# EAGLE design SparkFun_Level_Translator_PCA9306 (EAGLE 9.4.0)
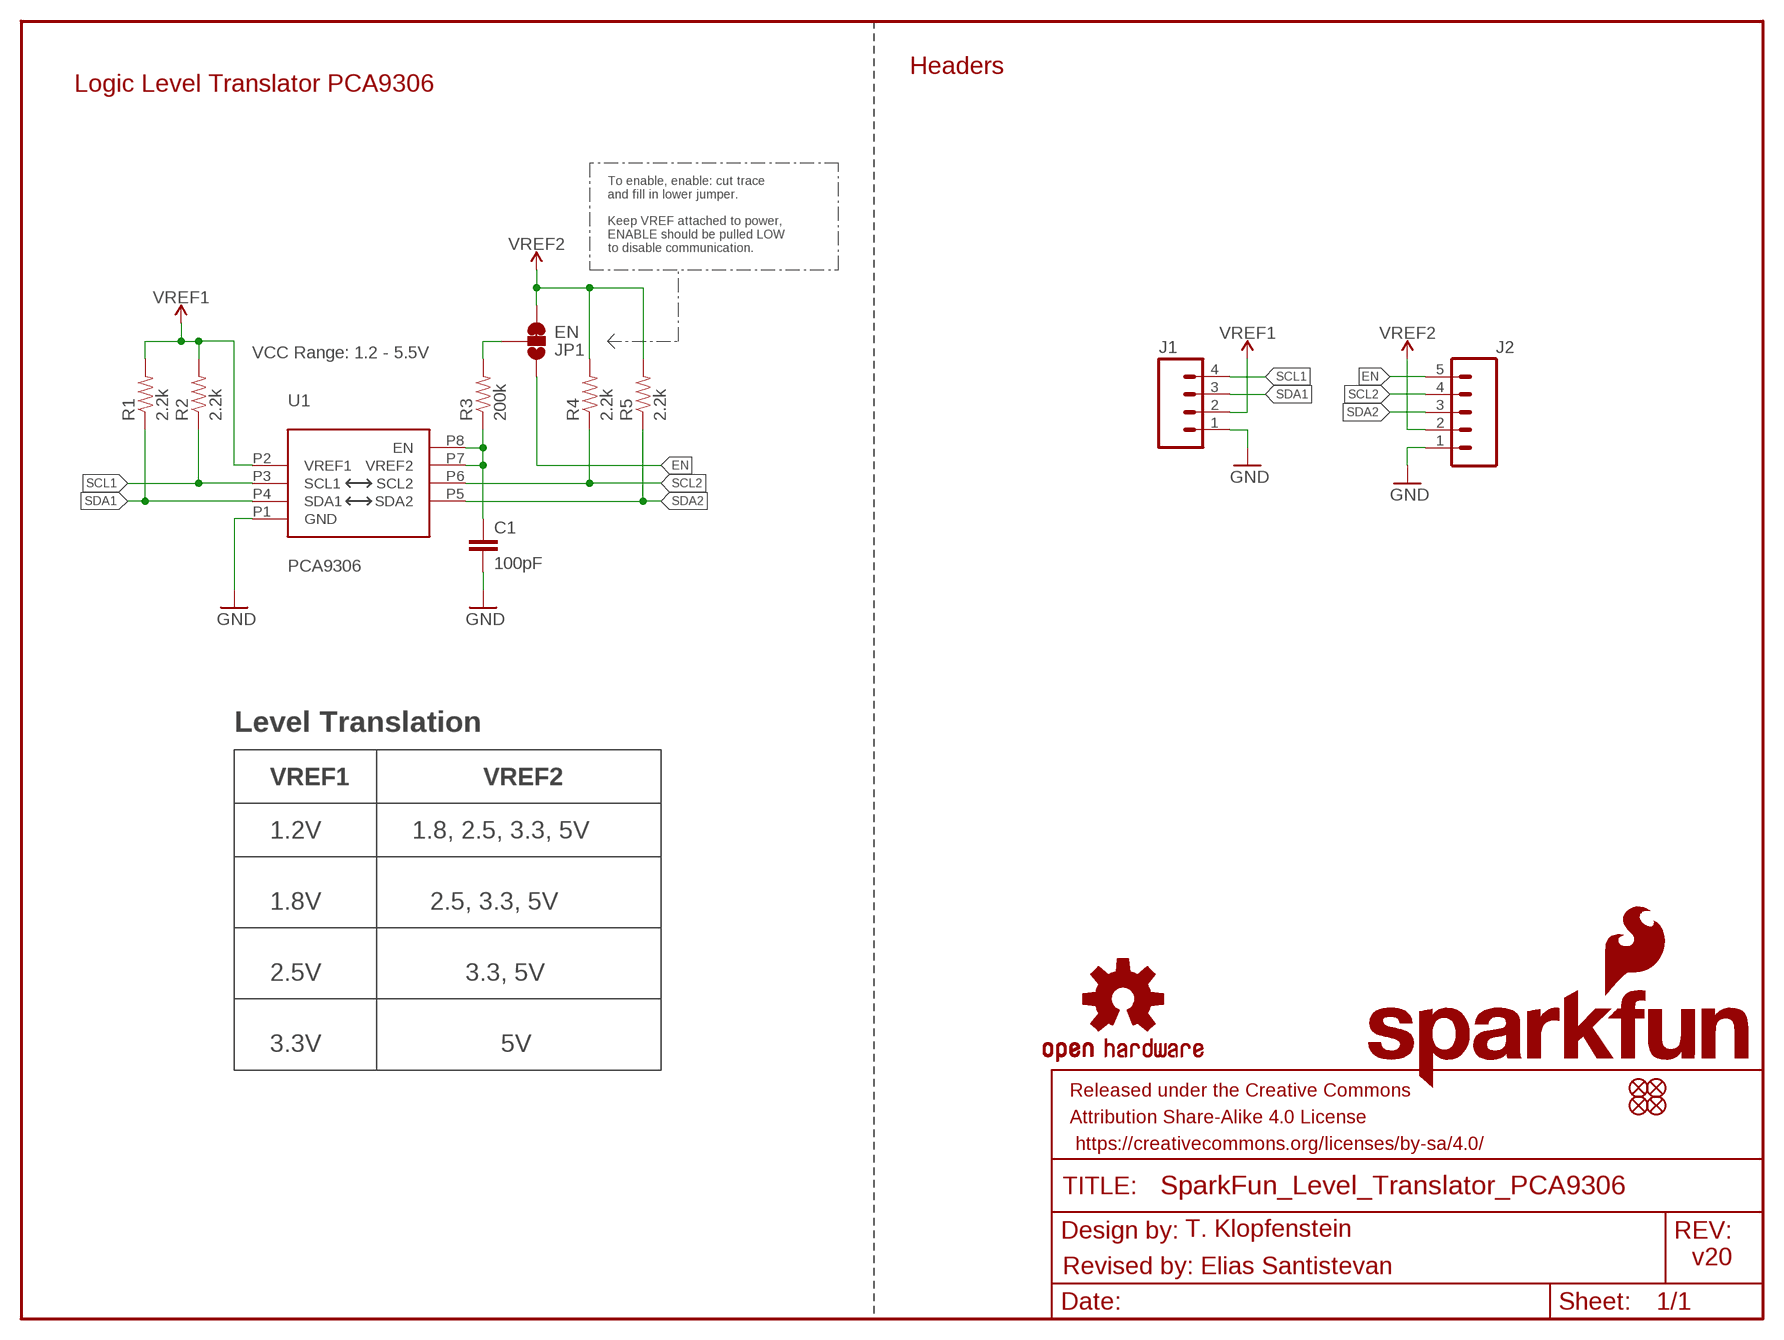
[diagram p0: schematic, sheet 1]

## Parts
C1  100pF  100PF-0603-50V-5%  [0603]
FD1  FIDUCIALUFIDUCIAL  [FIDUCIAL-MICRO]
FD2  FIDUCIALUFIDUCIAL  [FIDUCIAL-MICRO]
FD3  FIDUCIALUFIDUCIAL  [FIDUCIAL-MICRO]
FD4  FIDUCIALUFIDUCIAL  [FIDUCIAL-MICRO]
FRAME1  FRAME-LETTER  [CREATIVE_COMMONS]
J1  CONN_041X04_NO_SILK  [1X04_NO_SILK]
J2  CONN_05NO_SILK  [1X05_NO_SILK]
JP1  EN  JUMPER-SMT_3_1-NC_TRACE_SILK  [SMT-JUMPER_3_1-NC_TRACE_SILK]
LOGO1  OSHW-LOGOMINI  [OSHW-LOGO-MINI]
LOGO2  SFE_LOGO_NAME.1_INCH  [SFE_LOGO_NAME_.1]
LOGO3  SFE_LOGO_FLAME.1_INCH  [SFE_LOGO_FLAME_.1]
R1  2.2k  2.2KOHM-0603-1/10W-1%  [0603]
R2  2.2k  2.2KOHM-0603-1/10W-1%  [0603]
R3  200k  200KOHM-0603-1/10W-1%  [0603]
R4  2.2k  2.2KOHM-0603-1/10W-1%  [0603]
R5  2.2k  2.2KOHM-0603-1/10W-1%  [0603]
U1  PCA9306  PCA9306VSSOP_8PIN  [VSSOP_8PIN]

## Nets
EN: J2.5 JP1.1
GND: C1.2 J1.1 J2.1 U1.P1(GND)
JUMPER_IN: JP1.2 R3.2
SCL1: J1.4 R2.1 U1.P3(SCL1)
SCL2: J2.4 R4.1 U1.P6(SCL2)
SDA1: J1.3 R1.1 U1.P4(SDA1)
SDA2: J2.3 R5.1 U1.P5(SDA2)
VREF1: J1.2 R1.2 R2.2 U1.P2(VREF1)
VREF2: J2.2 JP1.3 R4.2 R5.2
VREF2_IN: C1.1 R3.1 U1.P7(VREF2) U1.P8(EN)

## Notes on the sheet
- Headers
- Logic Level Translator PCA9306
- To enable, enable: cut trace
  and fill in lower jumper.
- Keep VREF attached to power, 
  ENABLE should be pulled LOW
  to disable communication.
- VCC Range: 1.2 - 5.5V
- Level Translation
- VREF1 | VREF2
- 1.2V | 1.8, 2.5, 3.3, 5V
- 1.8V | 2.5, 3.3, 5V
- 2.5V | 3.3, 5V
- 3.3V | 5V
- T. Klopfenstein
- v20
- Revised by: Elias Santistevan

## Library data of the parts
C1 = SparkFun-Capacitors:100PF: 100pF/0.1nF ceramic capacitors A capacitor is a passive two-terminal electrical component used to store electrical energy temporarily in an electric field.; PROD_ID: CAP-07883
FD1-FD4 = SparkFun-Aesthetics:FIDUCIAL: Fiducial Alignment Points Point-of-reference for pick-and-place machines and other optical instruments.
FRAME1 = SparkFun-Aesthetics:FRAME-LETTER: Schematic Frame - Letter Standard 8.5x11 US Letter frame
J1 = SparkFun-Connectors:CONN_04: Multi connection point. Often used as Generic Header-pin footprint for 0.1 inch spaced/style header connections On any of the 0.1 inch spaced packages, you can populate with these: Break Away Headers - Straight <https://www.sparkfun.com/products/116> (PRT-00116) Break Away Male Headers - Right Angle <https://www.sparkfun.com/products/553> (PRT-00553) Female Headers <https://www.sparkfun.com/products/115> (PRT-00115) Break Away Headers - Machine Pin <https://www.sparkfun.com/products/117> (PRT-00117) Break Away Female Headers - Swiss Machine Pin <https://www.sparkfun.com/products/743> (PRT-00743) For SCREWTERMINALS and SPRING TERMINALS visit here: Screw Terimnals on SparkFun.com <https://www.sparkfun.com/search/results?term=Screw+Terminals> (5mm/3.5mm/2.54mm spacing) This device is also useful as a general connection point to wire up your design to another part of your project. Our various solder wires solder well into these plated through hole pads. Hook-Up Wire - Assortment (Stranded, 22 AWG) <https://www.sparkfun.com/products/11375> (PRT-11375) Hook-Up Wire - Assortment (Solid Core, 22 AWG) <https://www.sparkfun.com/products/11367> (PRT-11367) View the entire wire category on our website here <https://www.sparkfun.com/categories/141> Special notes: Molex polarized connector foot print use with SKU : PRT-08231 with associated crimp pins and housings. 1MM SMD Version SKU: PRT-10208; PROD_ID: CONN-09696
J2 = SparkFun-Connectors:CONN_05: Multi connection point. Often used as Generic Header-pin footprint for 0.1 inch spaced/style header connections On any of the 0.1 inch spaced packages, you can populate with these: Break Away Headers - Straight <https://www.sparkfun.com/products/116> (PRT-00116) Break Away Male Headers - Right Angle <https://www.sparkfun.com/products/553> (PRT-00553) Female Headers <https://www.sparkfun.com/products/115> (PRT-00115) Break Away Headers - Machine Pin <https://www.sparkfun.com/products/117> (PRT-00117) Break Away Female Headers - Swiss Machine Pin <https://www.sparkfun.com/products/743> (PRT-00743) For SCREWTERMINALS and SPRING TERMINALS visit here: Screw Terimnals on SparkFun.com <https://www.sparkfun.com/search/results?term=Screw+Terminals> (5mm/3.5mm/2.54mm spacing) This device is also useful as a general connection point to wire up your design to another part of your project. Our various solder wires solder well into these plated through hole pads. Hook-Up Wire - Assortment (Stranded, 22 AWG) <https://www.sparkfun.com/products/11375> (PRT-11375) Hook-Up Wire - Assortment (Solid Core, 22 AWG) <https://www.sparkfun.com/products/11367> (PRT-11367) View the entire wire category on our website here <https://www.sparkfun.com/categories/141> Special notes: Molex polarized connector foot print use with SKU : PRT-08231 with associated crimp pins and housings. 1MM SMD Version SKU: PRT-10208
JP1 = SparkFun-Jumpers:JUMPER-SMT_3_1-NC_TRACE: Normally closed trace jumper (1 of 2 connections) This jumper has a trace between two pads so it's normally closed (NC). The other connection is normally open (NO). Use a razor knife to open the connection. For best results follow the IPC guidelines for cutting traces: Cutout at least 0.063 mm (0.005 in). Remove all loose material to clean up the cut area. Seal the cut with an approved epoxy. Reapply solder to reclose the connection, or to close the NO connection.
LOGO1 = SparkFun-Aesthetics:OSHW-LOGO: Open-Source Hardware (OSHW) Logo This logo indicates the piece of hardware it is found on incorporates a OSHW license and/or adheres to the definition of open source hardware found here: http://freedomdefined.org/OSHW
LOGO2 = SparkFun-Aesthetics:SFE_LOGO_NAME: SparkFun Font Logo This is the SparkFun name logo. The logo on the schematic will always be the same size; the package variant is the height of the flame part of the logo (or the height the flame would be, if it were drawn). Default layer for the logo on the board is tSilk.
LOGO3 = SparkFun-Aesthetics:SFE_LOGO_FLAME: SparkFun Flame Logo This is the SparkFun flame logo. The logo on the schematic will always be the same size; the package variant is the height of the flame. Default layer for the logo on the board is tSilk.
R1 R2 R4 R5 = SparkFun-Resistors:2.2KOHM: 2.2kΩ resistor A resistor is a passive two-terminal electrical component that implements electrical resistance as a circuit element. Resistors act to reduce current flow, and, at the same time, act to lower voltage levels within circuits. - Wikipedia; PROD_ID: RES-08272
R3 = SparkFun-Resistors:200KOHM: 200kΩ resistor A resistor is a passive two-terminal electrical component that implements electrical resistance as a circuit element. Resistors act to reduce current flow, and, at the same time, act to lower voltage levels within circuits. - Wikipedia; PROD_ID: RES-09385
U1 = SparkFun-IC-Comms:PCA9306: Bidirectional I2C level shifter Not compatible with all available part number pinout schemes- DOUBLE CHECK!!! Variants PCA9306DC and PSOP-8 are EOL. If your part has VREF as pin 1 then this is your variant. VSSOP_8PIN is not EOL. Datasheet <https://cdn.sparkfun.com/datasheets/BreakoutBoards/PCA9306DC.pdf> SparkFun Products SparkFun Inventor's Kit for RedBot <https://www.sparkfun.com/products/12649> (ROB-12649) SparkFun RedBot Basic Kit <https://www.sparkfun.com/products/13166> (ROB-13166) SparkFun Level Translator Breakout - PCA9306 <https://www.sparkfun.com/products/11955> (BOB-11955) SparkFun Block for Intel Edison - ADC <https://www.sparkfun.com/products/13770> (DEV-13770) SparkFun Block for Intel® Edison - Raspberry Pi B <https://www.sparkfun.com/products/13044> (DEV-13044) SparkFun RedBot Sensor - Accelerometer <https://www.sparkfun.com/products/12589> (SEN-12589); PROD_ID: IC-14450

## Board
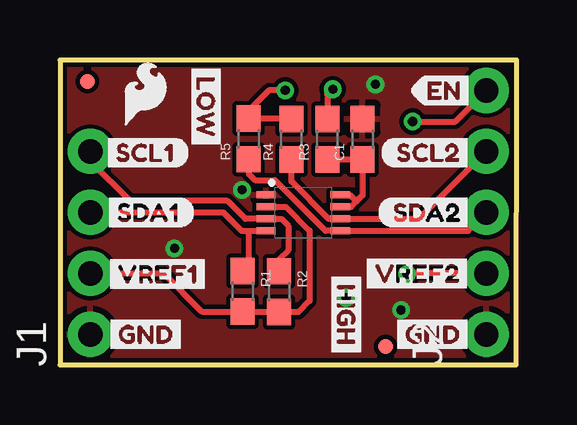
[diagram p1: board, top side]
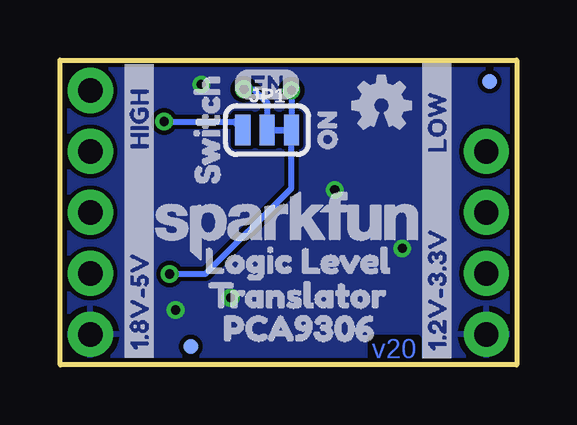
[diagram p2: board, bottom side, seen from below]

Size 19.05 x 12.7 mm. Coordinates in mm from the lower left corner, seen from the top.
Outline: 0,0 19.03,0 19.05,12.7 0,12.7 0,0
Copper layers (1*16): Top 0.035mm / dielectric 1.5mm / Bottom 0.035mm
Design rules "SparkFun-2-layer-TIGHT": minimum track width 7mil, minimum drill 15mil, track to track 7mil, track to pad 7mil, pad to pad 7mil, via to via 7mil, smd to smd 7mil, copper to edge 7mil, drill to drill 7mil, minimum pad ring 7mil, minimum via ring 7mil, stop-mask expansion 4mil, vias tented up to drill 25mil, thermal gap 10mil

### Footprints (pad centres in the part's own frame; a part is rotated, then mirrored left to right if it is on the bottom)
0603 = smd 1.1 x 1: 1 -0.85,0; 2 0.85,0
FIDUCIAL-MICRO = smd 0.635 x 0.635: 1 0,0
1X04_NO_SILK = drill 1.016 pad 1.88: 1 0,0; 2 2.54,0; 3 5.08,0; 4 7.62,0
1X05_NO_SILK = drill 1.016 pad 1.88: 1 0,0; 2 2.54,0; 3 5.08,0; 4 7.62,0; 5 10.16,0
SMT-JUMPER_3_1-NC_TRACE_SILK = smd 0.635 x 1.27: 1 -1.016,0; 2 0,0; 3 1.016,0
VSSOP_8PIN = smd 0.8 x 0.3: P1 -1.57,0.734; P2 -1.57,0.234; P3 -1.57,-0.266; P4 -1.57,-0.766; P5 1.53,-0.766; P6 1.53,-0.266; P7 1.53,0.234; P8 1.53,0.734

### Placement (x,y rotation side)
C1  12.62,9.4 90 top
FD1  1.14,11.81 90 bottom
FD2  13.59,0.76 90 top
FD3  1.14,11.81 90 top
FD4  13.59,0.76 90 bottom
FRAME1  -4.94,-10.16 0 top  (outside the outline)
J1  1.27,1.27 90 top
J2  17.78,1.27 90 top
JP1  10.41,9.78 0 bottom
LOGO1  5.64,10.82 0 bottom
LOGO2  9.58,5.79 0 bottom
LOGO3  3.56,11.3 0 top
R1  7.62,3.06 270 top
R2  9.14,3.05 270 top
R3  11.15,9.4 90 top
R4  9.65,9.4 90 top
R5  7.87,9.41 90 top
U1  10.16,6.35 0 top
U$1  [SWITCH1]  12.9,6.6 90 bottom
U$2  [VREF13]  1.7,3.78 0 top
U$3  [SCL11]  1.63,8.84 0 top
U$4  [SDA10]  1.7,6.35 0 top
U$5  [GND2]  1.75,1.27 0 top
U$6  [VREF20]  12.45,3.81 0 top
U$7  [SCL20]  13.36,8.84 0 top
U$8  [SDA21]  13.21,6.35 0 top
U$9  [EN0]  14.61,11.43 0 top
U$10  [EN1]  11.81,11.68 0 bottom
U$11  [GND2]  13.72,1.27 0 top
U$12  [LOGIC_LEVEL0]  13.92,4.34 0 bottom
U$13  [TRANSLATOR1]  13.77,2.9 0 bottom
U$14  [PCA93062]  13.16,1.52 0 bottom
U$15  [ON2]  7.9,8.18 90 bottom
U$17  [HIGH0]  15.75,8.28 90 bottom
U$18  [LOW1]  3.33,8.15 90 bottom
U$19  [HIGH0]  11.94,4.06 270 top
U$20  [LOW1]  6.1,12.7 270 top
U$21  [1#2V#3#3V0]  3.33,-0.13 90 bottom
U$22  [1#8V#5V1]  15.75,-0.1 90 bottom

### Tracks (layer width: path | path; a pad name or v marks a point on that pad's centre or on a via)
EN  (via drill 0.38)
  Top 0.254: v14.71,10.13 16.48,10.13 J2.5
  Bottom 0.254: JP1.1 11.79,10.13 v14.71,10.13
GND  (via drill 0.38)
  other vias: 7.59,7.29 4.78,4.85 11.94,2.79 13.16,11.68 14.22,2.29
  pour Bottom: 0,12.7 19.05,12.7 19.05,0 0,0
  pour Top: 0,12.7 19.05,12.7 19.05,0 0,0
JUMPER_IN  (via drill 0.38)
  Top 0.254: v11.38,11.48 11.15,11.25 R3.2
  Bottom 0.254: v11.38,11.48 10.97,11.48 10.41,10.92 JP1.2
SCL1
  Top 0.254: R2.1 9.14,4.39 9.53,4.78 9.53,5.79 9.23,6.08 U1.P3 7.73,6.08 6.99,6.83 2.92,6.83 1.27,8.48 J1.4
SCL2
  Top 0.254: R4.1 9.65,7.64 11.21,6.08 U1.P6 14.97,6.08 J2.4
SDA1
  Top 0.254: J1.3 6.81,6.35 7.57,5.58 7.87,5.58 | 7.87,5.58 U1.P4 | 7.87,5.58 7.87,4.17 R1.1
SDA2
  Top 0.254: J2.3 17.01,5.58 U1.P5 11.07,5.58 8.97,7.69 8.14,7.69 7.87,7.96 R5.1
VREF1
  Top 0.254: J1.2 4.32,3.81 5.91,2.21 R1.2 9.13,2.21 R2.2 9.95,2.2 10.41,2.67 10.41,5.59 9.42,6.58 U1.P2
VREF2  (via drill 0.38)
  Top 0.254: R4.2 7.89,10.25 R5.2 7.87,10.59 8.71,11.43 v9.4,11.43 | J2.2 14.48,3.81 v14.48,3.79
  Bottom 0.254: v9.4,11.43 JP1.3 9.4,7.37 12.98,3.79 v14.48,3.79
VREF2_IN
  Top 0.254: R3.1 C1.1 12.62,7.06 12.37,6.81 | 12.37,6.81 12.15,6.58 U1.P7 | U1.P8 12.09,7.08 12.37,6.81

### Text on the board
Bottom: v20
tValues: T. Klopfenstein
Measures: Units in Inches
tDocu: Toni Klopfenstein | Revised by: Elias Santistevan